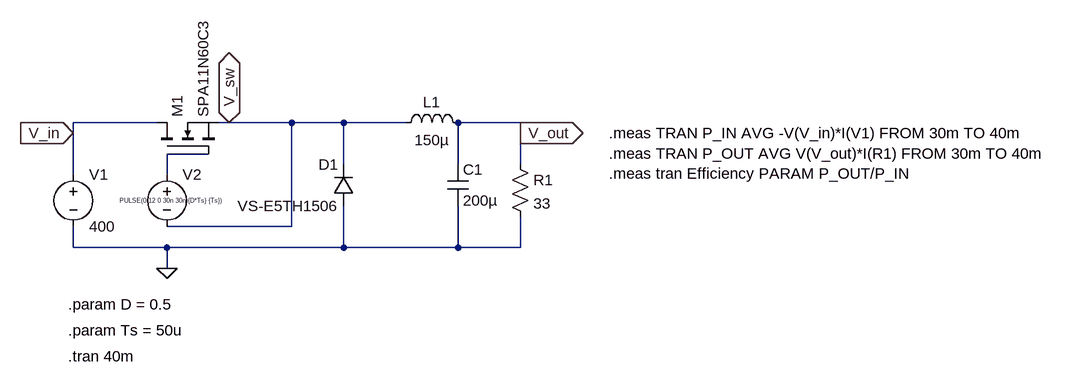
[diagram p0: schematic Si_MOSFET.asc]
Si_MOSFET.asc, the LTspice schematic file:
Version 4.1
SHEET 1 1752 680
WIRE 144 80 16 80
WIRE 256 80 240 80
WIRE 352 80 256 80
WIRE 432 80 352 80
WIRE 528 80 432 80
WIRE 704 80 608 80
WIRE 16 96 16 80
WIRE 704 96 704 80
WIRE 224 128 160 128
WIRE 432 144 432 80
WIRE 608 144 608 80
WIRE 704 144 704 96
WIRE 16 160 16 96
WIRE 160 160 160 128
WIRE 352 240 352 80
WIRE 352 240 160 240
WIRE 16 272 16 240
WIRE 160 272 16 272
WIRE 432 272 432 208
WIRE 432 272 160 272
WIRE 608 272 608 208
WIRE 608 272 432 272
WIRE 704 272 704 224
WIRE 704 272 608 272
WIRE 160 304 160 272
FLAG 160 304 0
FLAG 704 96 V_out
IOPIN 704 96 Out
FLAG 16 96 V_in
IOPIN 16 96 In
FLAG 256 80 V_sw
IOPIN 256 80 BiDir
SYMBOL voltage 16 144 R0
WINDOW 123 0 0 Left 0
WINDOW 39 0 0 Left 0
SYMATTR InstName V1
SYMATTR Value 400
SYMBOL nmos 144 128 R270
SYMATTR InstName M1
SYMATTR Value SPA11N60C3
SYMBOL ind 512 96 R270
WINDOW 0 32 56 VTop 2
WINDOW 3 5 56 VBottom 2
SYMATTR InstName L1
SYMATTR Value 150µ
SYMBOL cap 592 144 R0
SYMATTR InstName C1
SYMATTR Value 200µ
SYMBOL res 688 128 R0
SYMATTR InstName R1
SYMATTR Value 33
SYMBOL voltage 160 144 R0
WINDOW 123 0 0 Left 0
WINDOW 39 0 0 Left 0
WINDOW 3 -73 56 Left 0
SYMATTR InstName V2
SYMATTR Value PULSE(0 12 0 30n 30n {D*Ts} {Ts})
SYMBOL diode 448 208 R180
WINDOW 0 24 64 Left 2
WINDOW 3 24 0 Left 2
SYMATTR InstName D1
SYMATTR Value VS-E5TH1506
TEXT 8 360 Left 2 !.param D = 0.5
TEXT 8 400 Left 2 !.param Ts = 50u
TEXT 8 440 Left 2 !.tran 40m
TEXT 840 96 Left 2 !.meas TRAN P_IN AVG -V(V_in)*I(V1) FROM 30m TO 40m\n.meas TRAN P_OUT AVG V(V_out)*I(R1) FROM 30m TO 40m\n.meas tran Efficiency PARAM P_OUT/P_IN

The netlist it stands for:
* Si_MOSFET.asc
V1 V_in 0 400
M1 V_in N001 V_sw V_sw SPA11N60C3
L1 V_sw V_out 150µ
C1 V_out 0 200µ
R1 V_out 0 33
V2 N001 V_sw PULSE(0 12 0 30n 30n {D*Ts} {Ts})
D1 0 V_sw VS-E5TH1506
.model D D
.lib standard.dio
.model NMOS NMOS
.model PMOS PMOS
.lib standard.mos
.param D = 0.5
.param Ts = 50u
.tran 40m
.meas TRAN P_IN AVG -V(V_in)*I(V1) FROM 30m TO 40m
.meas TRAN P_OUT AVG V(V_out)*I(R1) FROM 30m TO 40m
.meas tran Efficiency PARAM P_OUT/P_IN
.backanno
.end